# EAGLE design Pixie85Servo (EAGLE 7.5.0)
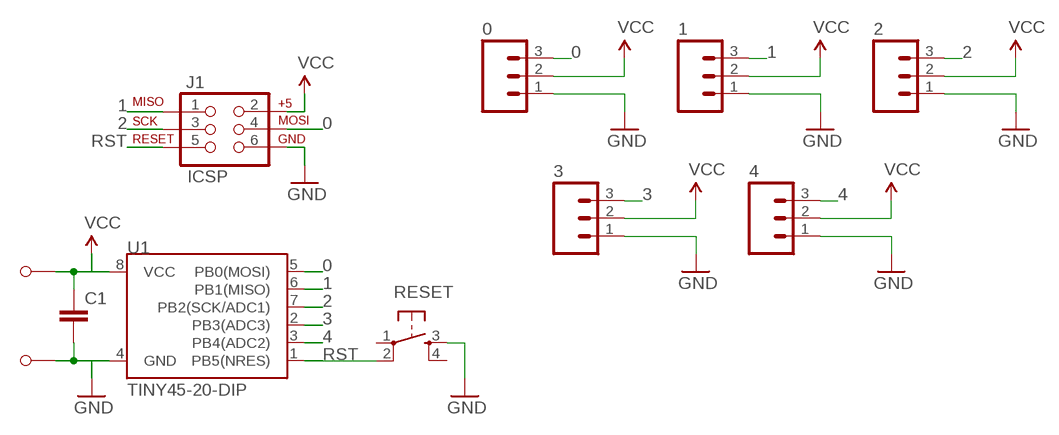
[diagram p0: schematic, sheet 1]

## Parts
0  M03PTH  [1X03]
1  M03PTH  [1X03]
2  M03PTH  [1X03]
3  M03PTH  [1X03]
4  M03PTH  [1X03]
+  M1  [M1_NO_STRAIN]
-  M1  [M1_NO_STRAIN]
C1  CAPPTH  [CAP-PTH-SMALL]
J1  ICSP  AVR_SPI_PRG_6LABELED  [2X3-NS]
RESET  TAC_SWITCHPTH  [TACTILE-PTH]
U1  TINY45-20-DIP  ATTINY45TINY45-20-DIP  [DIP08]

## Nets
0: 0.3 J1.4(MOSI) U1.5(PB0(MOSI))
1: 1.3 J1.1(MISO) U1.6(PB1(MISO))
2: 2.3 J1.3(SCK) U1.7(PB2(SCK/ADC1))
3: 3.3 U1.2(PB3(ADC3))
4: 4.3 U1.3(PB4(ADC2))
GND: 0.1 1.1 2.1 3.1 4.1 -.P$1 C1.2 J1.6(GND) RESET.3 U1.4(GND)
RST: J1.5(RST) RESET.2 U1.1(PB5(NRES))
VCC: 0.2 1.2 2.2 3.2 4.2 +.P$1 C1.1 J1.2(V+) U1.8(VCC)
Unconnected: RESET.1 RESET.4

## Library data of the parts
0 1-4 = SparkFun-Connectors:M03: Header 3 Standard 3-pin 0.1" header. Use with straight break away headers (SKU : PRT-00116), right angle break away headers (PRT-00553), swiss pins (PRT-00743), machine pins (PRT-00117), and female headers (PRT-00115). Molex polarized connector foot print use with SKU : PRT-08232 with associated crimp pins and housings.
+ - = barbary_enterprises:M1
C1 = barbary_enterprises:CAP: Capacitor Standard 0603 ceramic capacitor, and 0.1" leaded capacitor.
J1 = barbary_enterprises:AVR_SPI_PRG_6: AVR ISP 6 Pin This is the reduced ISP connector for AVR programming. Common on Arduino. This footprint will take up less PCB space and can be used with a 10-pin to 6-pin adapter such as SKU: BOB-08508
RESET = barbary_enterprises:TAC_SWITCH: Momentary Switch Button commonly used for reset or general input. Spark Fun Electronics SKU : COM-00097 SMT- SWCH-08247
U1 = SparkFun-DigitalIC:ATTINY45: Atmel 8-pin 2/4/8kB flash uC; PROD_ID: IC-09439

## Board
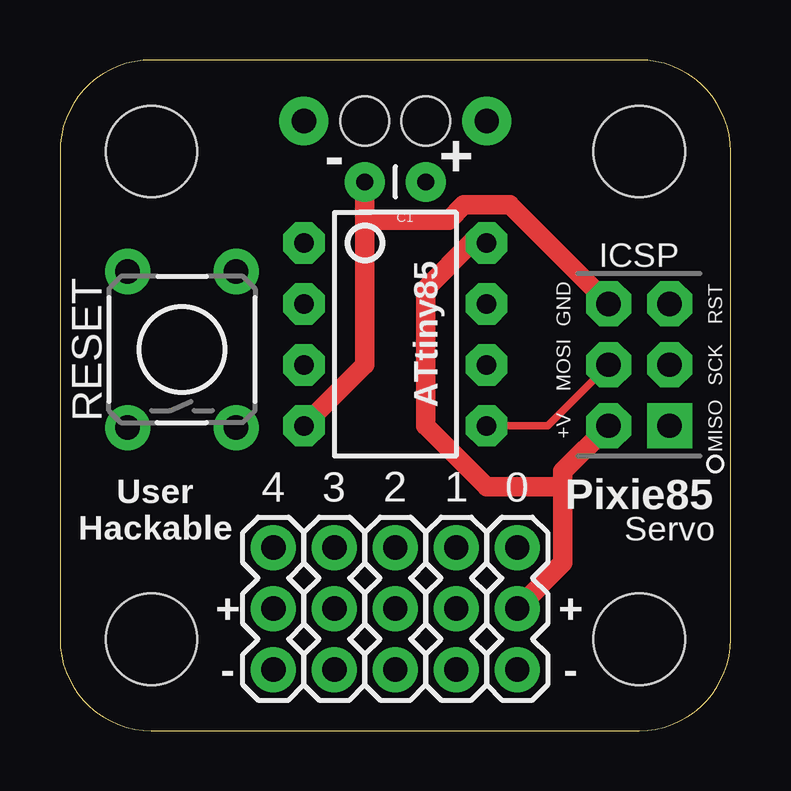
[diagram p1: board, top side]
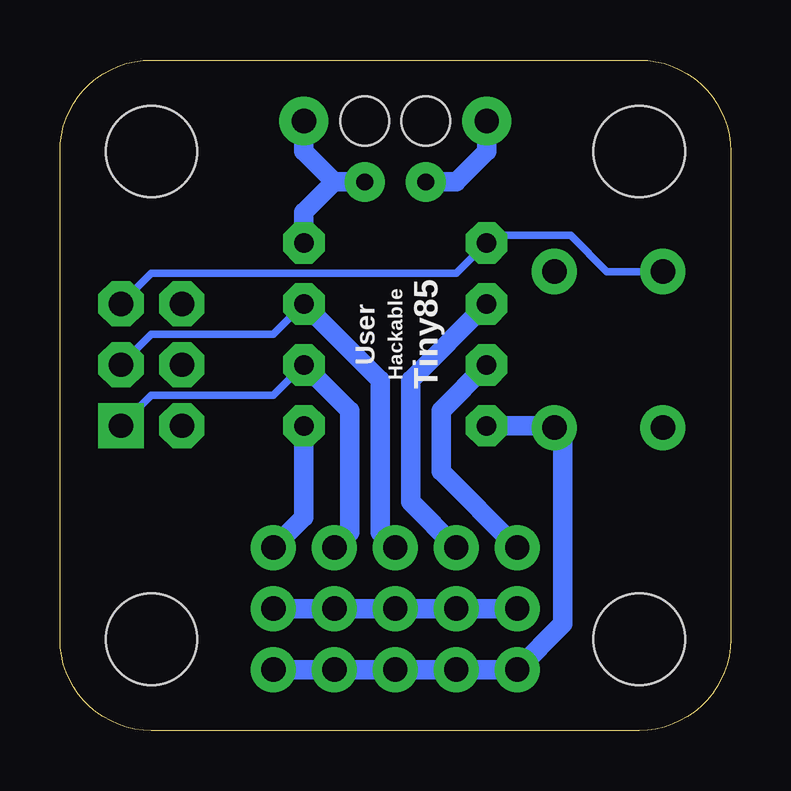
[diagram p2: board, bottom side, seen from below]

Size 27.94 x 27.94 mm. Coordinates in mm from the lower left corner, seen from the top.
Outline: 27.94,3.81 27.94,24.13 arc90 24.13,27.94 3.81,27.94 arc90 0,24.13 0,3.81 arc90 3.81,0 24.13,0 arc90 27.94,3.81
Copper layers (1*16): Top 0.0356mm / dielectric 1.5011mm / Bottom 0.0356mm
Design rules "LaenPCBOrder": minimum track width 6mil, minimum drill 13mil, track to track 6mil, track to pad 6mil, pad to pad 6mil, via to via 6mil, smd to smd 6mil, copper to edge 15mil, drill to drill 6mil, minimum pad ring 7mil, minimum via ring 7mil, stop-mask expansion 3mil, vias tented up to drill 0mil, thermal gap 10mil
Holes 3.81 mm at 3.81,3.81 24.13,3.81 3.81,24.13 24.13,24.13

### Footprints (pad centres in the part's own frame; a part is rotated, then mirrored left to right if it is on the bottom)
1X03 = drill 1.016 pad 1.88: 1 0,0; 2 2.54,0; 3 5.08,0
M1_NO_STRAIN = drill 1.016 pad 2.032: P$1 0,0 | hole 2.032: 2.54,0
CAP-PTH-SMALL = drill 0.7 pad 1.651: 1 0,0; 2 2.54,0
2X3-NS = drill 1.016 pad 1.88 square: 1 -2.54,-1.27 | drill 1.016 pad 1.88 octagon: 2 -2.54,1.27; 3 0,-1.27; 4 0,1.27; 5 2.54,-1.27; 6 2.54,1.27
TACTILE-PTH = drill 1.016 pad 1.88: 1 -3.251,2.261; 2 3.251,2.261; 3 -3.251,-2.261; 4 3.251,-2.261
DIP08 = drill 0.813 pad 1.727 octagon: 1 -3.81,-3.81; 2 -1.27,-3.81; 3 1.27,-3.81; 4 3.81,-3.81; 5 3.81,3.81; 6 1.27,3.81; 7 -1.27,3.81; 8 -3.81,3.81

### Placement (x,y rotation side)
0  19.05,2.54 90 top
1  16.51,2.54 90 top
2  13.97,2.54 90 top
3  11.43,2.54 90 top
4  8.89,2.54 90 top
+  17.78,25.4 180 top
-  10.16,25.4 0 top
C1  15.24,22.86 180 top
J1  24.13,15.24 90 top
RESET  5.08,15.88 90 top
U1  13.97,16.51 270 top

### Tracks (layer width: path | path; a pad name or v marks a point on that pad's centre or on a via)
0
  Top 0.305: J1.4 20.32,12.7 U1.5
  Bottom 0.813: 0.3 17.78,8.89 U1.5
1
  Bottom 0.305: J1.1 24.13,13.97 19.05,13.97 U1.6
  Bottom 0.813: U1.6 15.88,13.34 15.88,8.26 1.3
2
  Bottom 0.305: J1.3 24.13,16.51 19.05,16.51 U1.7
  Bottom 0.813: U1.7 14.61,14.61 14.61,8.26 2.3
3
  Bottom 0.813: U1.2 13.34,14.61 13.34,9.53 3.3
4
  Bottom 0.813: U1.3 12.06,13.34 12.06,10.79 4.3
GND
  Top 0.813: C1.2 12.7,21.27 | 12.7,21.27 12.7,15.24 U1.4 | J1.6 18.73,21.91 16.83,21.91 16.19,21.27 12.7,21.27
  Bottom 0.813: 0.1 1.1 2.1 3.1 4.1 6.99,4.45 6.99,12.27 RESET.3 7.42,12.7 U1.4 | -.P$1 10.16,24.13 11.43,22.86 C1.2
RST
  Bottom 0.305: J1.5 24.13,19.05 11.43,19.05 U1.1 9.84,20.64 6.67,20.64 5.16,19.13 RESET.2
VCC
  Top 0.813: U1.8 17.14,20.32 15.24,18.41 15.24,12.7 17.78,10.16 20.95,10.16 | 20.95,10.16 20.95,10.79 J1.2 | 0.2 20.95,6.99 20.95,10.16
  Bottom 0.813: 4.2 3.2 2.2 1.2 0.2 | +.P$1 17.78,24.13 16.51,22.86 | 16.51,22.86 C1.1 | U1.8 17.78,21.59 16.51,22.86

### Text on the board
tPlace: - | + | ICSP | ATtiny85 | Pixie85 | User / Hackable | Servo | + | + | - | -
bPlace: Tiny85 | Hackable | User